# EAGLE design adsr-schematic (EAGLE 9.5.2)
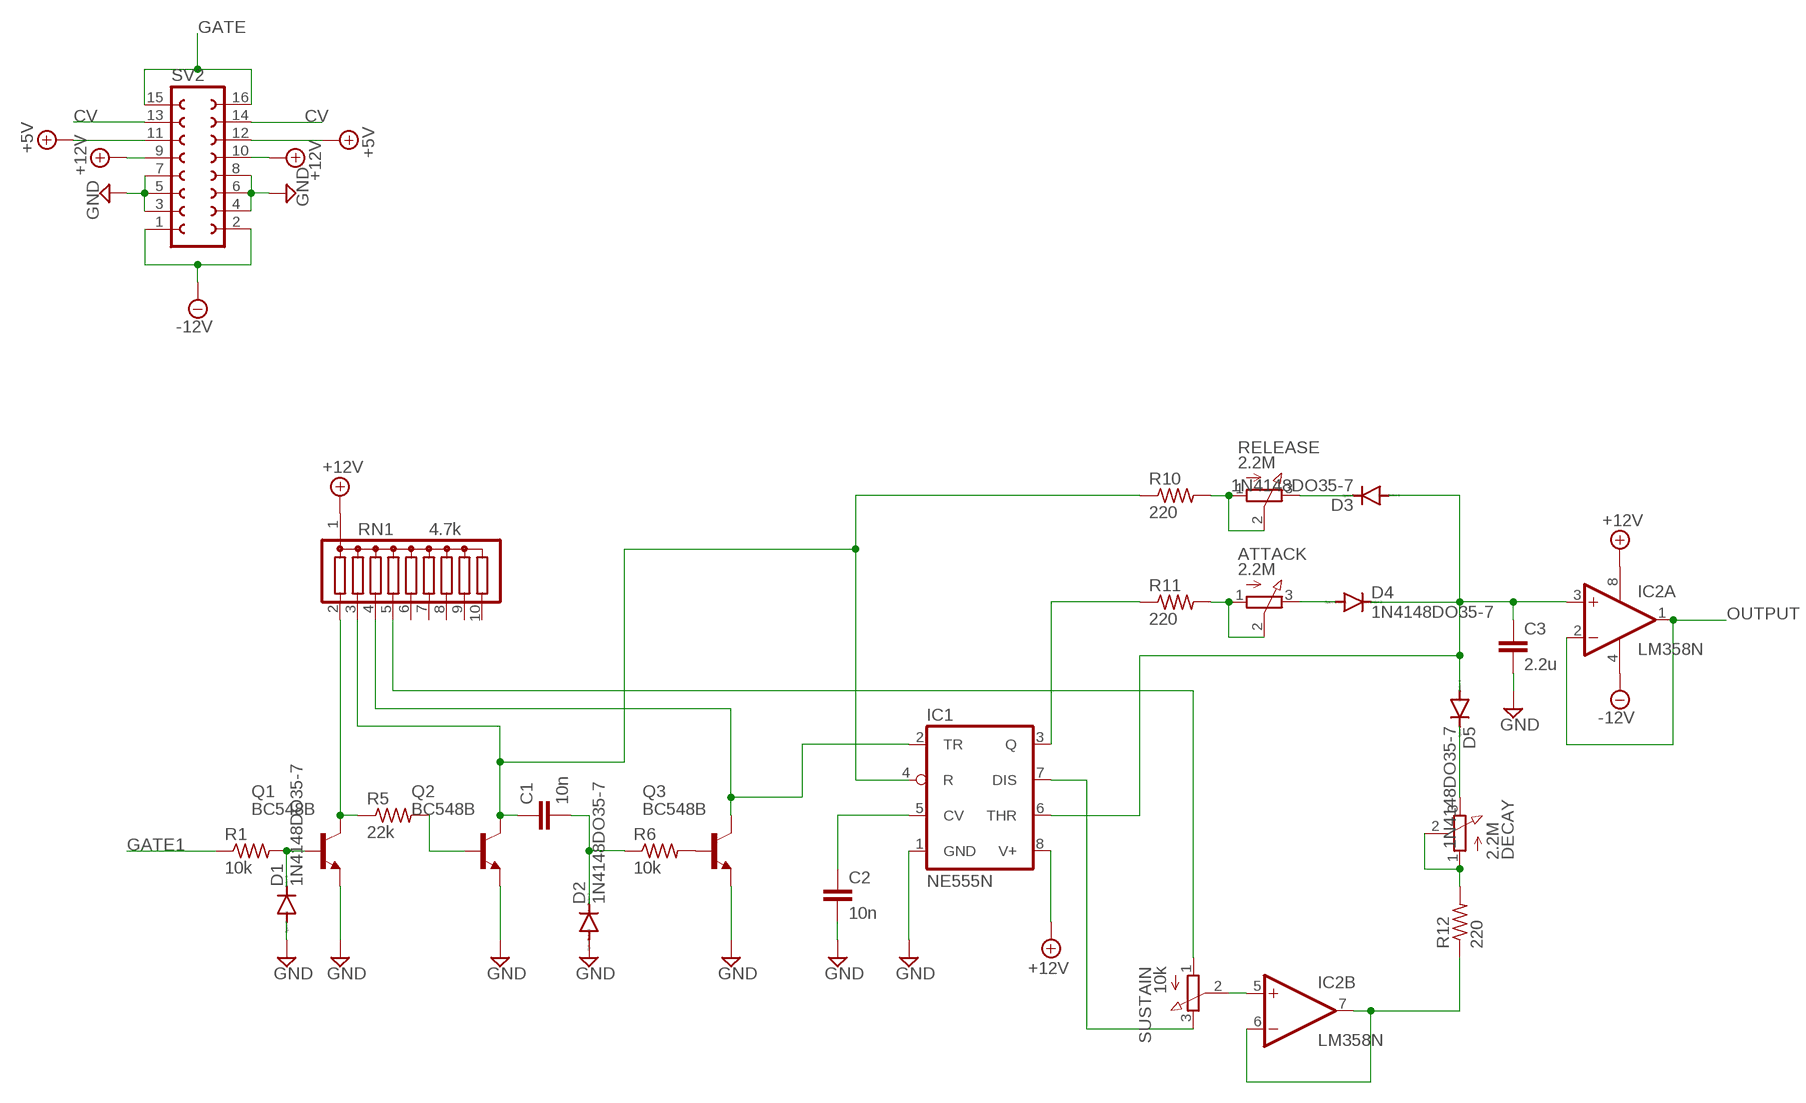
[diagram p0: schematic, sheet 1]

## Parts
ATTACK  2.2M  3RP/1610N  [3RP/1610N]
C1  10n  C2.5/4  [C2.5-4]
C2  10n  C2.5/4  [C2.5-4]
C3  2.2u  C2.5/4  [C2.5-4]
D1  1N4148DO35-7  [DO35-7]
D2  1N4148DO35-7  [DO35-7]
D3  1N4148DO35-7  [DO35-7]
D4  1N4148DO35-7  [DO35-7]
D5  1N4148DO35-7  [DO35-7]
DECAY  2.2M  3RP/1610N  [3RP/1610N]
IC1  NE555N  [DIL08]
IC2  LM358N  [DIL08]
Q1  BC548B  [TO92-EBC]
Q2  BC548B  [TO92-EBC]
Q3  BC548B  [TO92-EBC]
R1  10k  R-US_0204/5  [0204/5]
R5  22k  R-US_0204/5  [0204/5]
R6  10k  R-US_0204/5  [0204/5]
R10  220  R-US_0204/5  [0204/5]
R11  220  R-US_0204/5  [0204/5]
R12  220  R-US_0204/5  [0204/5]
RELEASE  2.2M  3RP/1610N  [3RP/1610N]
RN1  4.7k  G09R  [SIL10]
SUSTAIN  10k  3RP/1610N  [3RP/1610N]
SV2  FE08-2W  [FE08-2W]

## Nets
+5V: SV2.11 SV2.12
+12V: IC1.8(V+) IC2.8(P:V+) RN1.1 SV2.9 SV2.10
-12V: IC2.4(P:V-) SV2.1 SV2.2
CV: SV2.13 SV2.14
GATE: SV2.15 SV2.16
GATE1: R1.1
GND: C2.2 C3.2 D1.A D2.A IC1.1(GND) Q1.E Q2.E Q3.E SV2.3 SV2.4 SV2.5 SV2.6 SV2.7 SV2.8
N$1: D1.C Q1.B R1.2
N$2: Q1.C R5.1 RN1.2
N$3: C1.1 IC1.4(R) Q2.C R10.1 RN1.3
N$4: IC1.2(TR) Q3.C RN1.4
N$5: Q2.B R5.2
N$6: Q3.B R6.2
N$7: C1.2 D2.C R6.1
N$8: R10.2 RELEASE.1(A) RELEASE.2(S)
N$9: ATTACK.1(A) ATTACK.2(S) R11.2
N$10: DECAY.1(A) DECAY.2(S) R12.2
N$11: ATTACK.3(E) D4.A
N$12: C3.1 D3.A D4.C D5.A IC1.6(THR) IC2.3(A:+IN)
N$13: D5.C DECAY.3(E)
N$14: IC1.3(Q) R11.1
N$15: C2.1 IC1.5(CV)
N$16: IC2.5(B:+IN) SUSTAIN.2(S)
N$17: RN1.5 SUSTAIN.1(A)
N$18: IC2.6(B:-IN) IC2.7(B:OUT) R12.1
N$19: D3.C RELEASE.3(E)
N$20: IC1.7(DIS) SUSTAIN.3(E)
OUTPUT: IC2.1(A:OUT) IC2.2(A:-IN)
Unconnected: RN1.6 RN1.7 RN1.8 RN1.9 RN1.10

## Library data of the parts
ATTACK DECAY RELEASE SUSTAIN = pot:3RP/1610N: 16mm Potentiometer one level Source: http://www.alphapotentiometers.net/html/16mm_pot_2.html
C1-C3 = capacitor-wima:C: CAPACITOR naming: grid - package width
D1-D5 = diode:1N4148: DIODE high speed (Philips)
IC1 = linear:*555: TIMER
IC2 = linear:LM358: OP AMP also LM158; LM258; LM2904 Source: http://cache.national.com/ds/LM/LM158.pdf
Q1-Q3 = transistor-npn:BC548*: NPN Transistor
R1 R5 R6 R10-R12 = rcl:R-US_: RESISTOR, American symbol; SPICEPREFIX: R
RN1 = resistor-sil:G09R: SIL RESISTOR; OC_FARNELL: unknown; OC_NEWARK: unknown
SV2 = con-lsta:FE08-2W: FEMALE HEADER; OC_FARNELL: unknown; OC_NEWARK: unknown

## Board
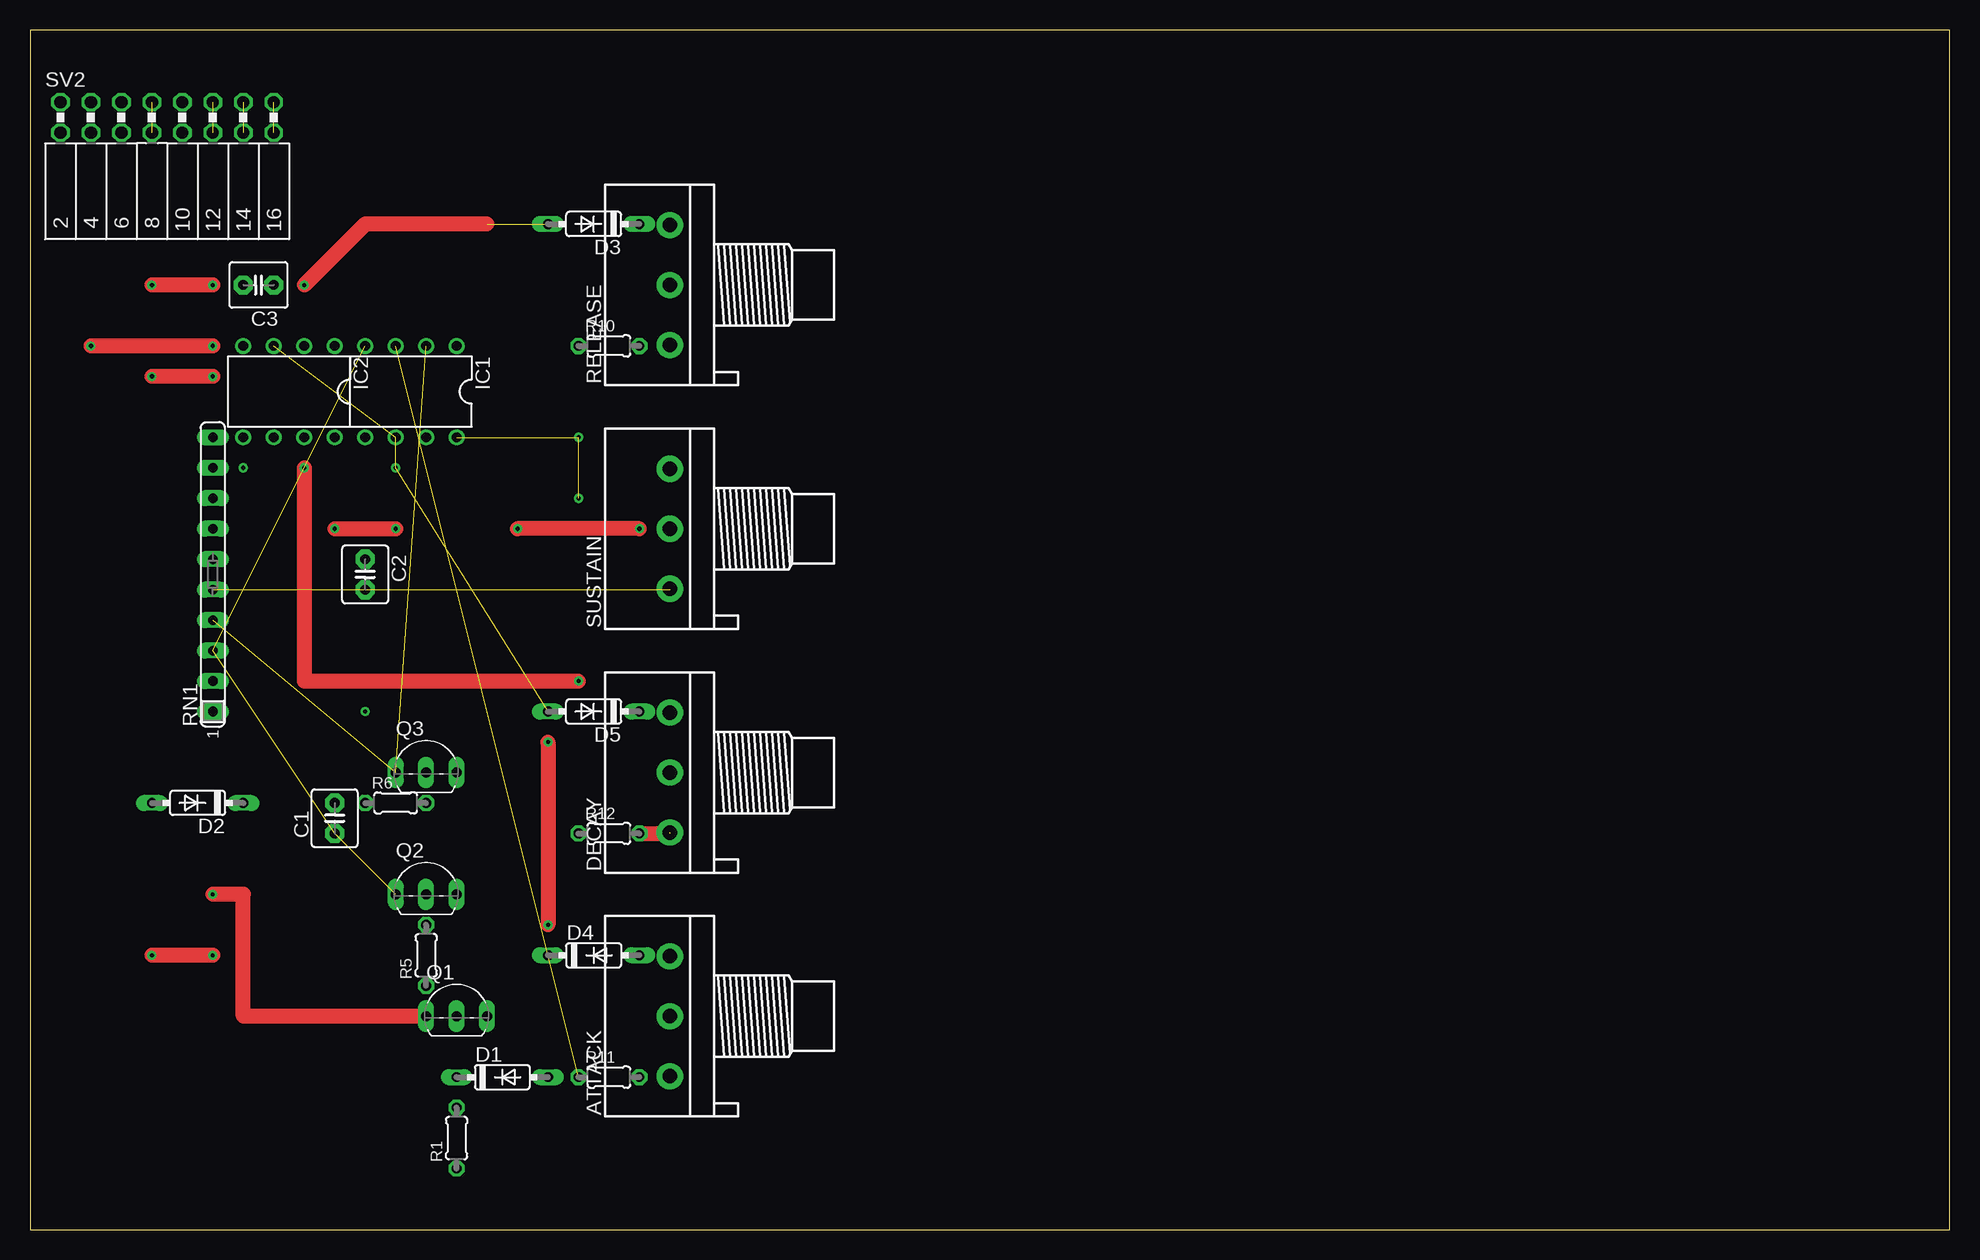
[diagram p1: board, top side]
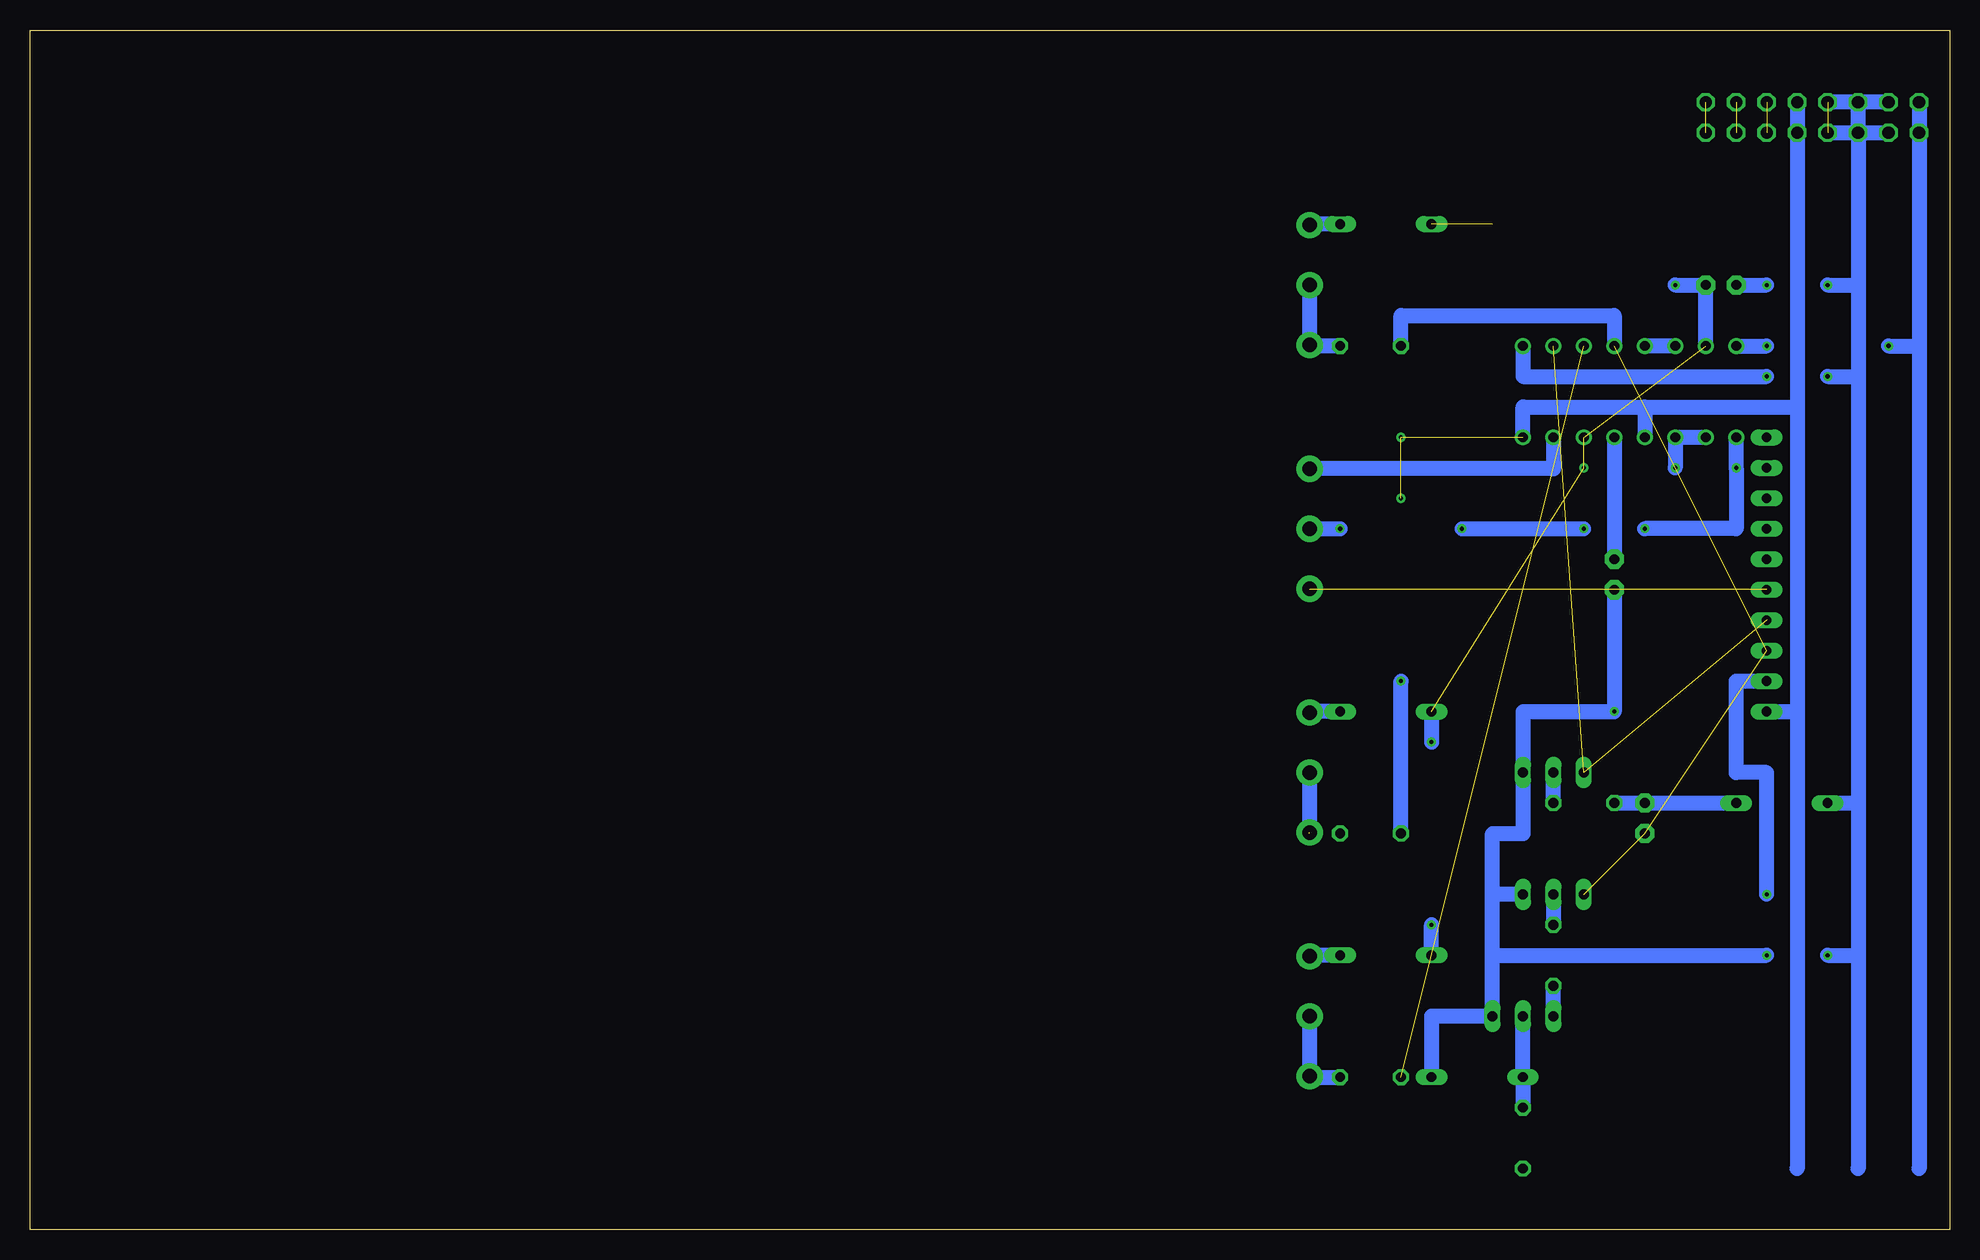
[diagram p2: board, bottom side, seen from below]

Size 160 x 100 mm. Coordinates in mm from the lower left corner, seen from the top.
Outline: 0,0 160,0 160,100 0,100 0,0
Copper layers (1*16): Top 0.035mm / dielectric 0.15mm / Bottom 0.035mm
Design rules "default": minimum track width 6mil, minimum drill 0.35mm, track to track 6mil, track to pad 6mil, pad to pad 6mil, via to via 6mil, smd to smd 6mil, copper to edge 40mil, drill to drill 6mil, minimum pad ring 10mil, minimum via ring 8mil, stop-mask expansion 4mil, vias tented up to drill 0mil, thermal gap 10mil

### Footprints (pad centres in the part's own frame; a part is rotated, then mirrored left to right if it is on the bottom)
3RP/1610N = drill 1.2 pad 2.184: 1 -5,0; 2 0,0; 3 5,0
C2.5-4 = drill 0.813 pad 1.6 octagon: 1 -1.27,0; 2 1.27,0
DO35-7 = drill 0.813 long: A 3.81,0; C -3.81,0
DIL08 = drill 0.813 pad 1.27: 1 -3.81,-3.81; 2 -1.27,-3.81; 3 1.27,-3.81; 4 3.81,-3.81; 5 3.81,3.81; 6 1.27,3.81; 7 -1.27,3.81; 8 -3.81,3.81
TO92-EBC = drill 0.813 long: B 0,-1.27; C -2.54,-1.27; E 2.54,-1.27
0204/5 = drill 0.813 octagon: 1 -2.54,0; 2 2.54,0
SIL10 = drill 0.813 long: 1 -11.43,0; 2 -8.89,0; 3 -6.35,0; 4 -3.81,0; 5 -1.27,0; 6 1.27,0; 7 3.81,0; 8 6.35,0; 9 8.89,0; 10 11.43,0
FE08-2W = drill 1.016 octagon: 1 -8.89,1.27; 2 -8.89,-1.27; 3 -6.35,1.27; 4 -6.35,-1.27; 5 -3.81,1.27; 6 -3.81,-1.27; 7 -1.27,1.27; 8 -1.27,-1.27; 9 1.27,1.27; 10 1.27,-1.27; 11 3.81,1.27; 12 3.81,-1.27; 13 6.35,1.27; 14 6.35,-1.27; 15 8.89,1.27; 16 8.89,-1.27

### Placement (x,y rotation side)
ATTACK  53.34,17.78 90 top
C1  25.4,34.29 90 top
C2  27.94,54.61 270 top
C3  19.05,78.74 180 top
D1  39.37,12.7 0 top
D2  13.97,35.56 180 top
D3  46.99,83.82 180 top
D4  46.99,22.86 0 top
D5  46.99,43.18 180 top
DECAY  53.34,38.1 90 top
IC1  31.75,69.85 180 top
IC2  21.59,69.85 180 top
Q1  35.56,19.05 0 top
Q2  33.02,29.21 0 top
Q3  33.02,39.37 0 top
R1  35.56,7.62 90 top
R5  33.02,22.86 90 top
R6  30.48,35.56 0 top
R10  48.26,73.66 0 top
R11  48.26,12.7 0 top
R12  48.26,33.02 0 top
RELEASE  53.34,78.74 90 top
RN1  15.24,54.61 90 top
SUSTAIN  53.34,58.42 90 top
SV2  11.43,92.71 0 top

### Tracks (layer width: path | path; a pad name or v marks a point on that pad's centre or on a via)
+5V  (1 unrouted)
+12V  (via drill 0.35)  (2 unrouted)
  Bottom 1.27: SV2.9 SV2.10 12.7,68.58 | 12.7,68.58 12.7,43.18 | 12.7,43.18 12.7,5.08 | IC1.8 35.56,68.58 25.4,68.58 | 25.4,68.58 IC2.8 | 25.4,68.58 12.7,68.58 | RN1.1 12.7,43.18
  other vias: 45.72,66.04 45.72,60.96
-12V  (via drill 0.35)
  Top 1.27: v15.24,73.66 v5.08,73.66
  Bottom 1.27: SV2.1 SV2.2 2.54,73.66 | 2.54,73.66 2.54,5.08 | IC2.4 v15.24,73.66 | v5.08,73.66 2.54,73.66
CV  (1 unrouted)
GATE  (1 unrouted)
GND  (via drill 0.35)  (1 unrouted)
  Top 1.27: v15.24,71.12 v10.16,71.12 | v15.24,22.86 v10.16,22.86 | v15.24,78.74 v10.16,78.74
  Bottom 1.27: SV2.3 SV2.5 | SV2.8 SV2.4 | SV2.5 SV2.6 7.62,78.74 | SV2.5 SV2.7 | 7.62,78.74 7.62,71.12 | 7.62,71.12 7.62,35.56 | 7.62,35.56 7.62,22.86 | 7.62,22.86 7.62,5.08 | 38.1,27.94 38.1,33.02 35.56,33.02 Q3.E 35.56,43.18 v27.94,43.18 C2.2 | Q2.E 38.1,27.94 | D1.A 43.18,17.78 Q1.E 38.1,22.86 | D2.A 7.62,35.56 | v10.16,78.74 7.62,78.74 | IC1.1 35.56,71.12 v15.24,71.12 | v10.16,71.12 7.62,71.12 | 38.1,22.86 38.1,27.94 | 38.1,22.86 v15.24,22.86 | v10.16,22.86 7.62,22.86 | C3.2 v15.24,78.74
N$1
  Bottom 1.27: R1.2 D1.C Q1.B
N$2  (via drill 0.35)
  Top 1.27: Q1.C 17.78,17.78 17.78,27.94 v15.24,27.94
  Bottom 1.27: Q1.C R5.1 | v15.24,27.94 15.24,38.1 17.78,38.1 17.78,45.72 RN1.2
N$3  (3 unrouted)
  Bottom 1.27: R10.1 45.72,76.2 27.94,76.2 IC1.4
N$4  (2 unrouted)
N$5
  Bottom 1.27: Q2.B R5.2
N$6
  Bottom 1.27: R6.2 Q3.B
N$7
  Bottom 1.27: R6.1 C1.2 D2.C
N$8
  Bottom 1.27: R10.2 53.34,73.66 RELEASE.1 RELEASE.2
N$9
  Bottom 1.27: R11.2 53.34,12.7 ATTACK.1 ATTACK.2
N$10  (2 unrouted)
  Top 1.27: R12.2 53.34,33.02
  Bottom 1.27: DECAY.2 53.34,33.02
N$11
  Bottom 1.27: D4.A 53.34,22.86 ATTACK.3
N$12  (via drill 0.35)  (4 unrouted)
  Top 1.27: 38.1,83.82 27.94,83.82 v22.86,78.74 | v43.18,40.64 v43.18,25.4
  Bottom 1.27: IC2.3 C3.1 v22.86,78.74 | D4.C v43.18,25.4 | D5.A v43.18,40.64
  other vias: 30.48,63.5
N$13
  Bottom 1.27: D5.C 53.34,43.18 DECAY.3
N$14  (1 unrouted)
N$15
  Bottom 1.27: IC1.5 C2.1
N$16  (via drill 0.35)
  Top 1.27: v50.8,58.42 v40.64,58.42 | v25.4,58.42 v30.48,58.42
  Bottom 1.27: SUSTAIN.2 v50.8,58.42 | IC2.5 v17.78,63.5 17.78,58.42 v25.4,58.42 | v40.64,58.42 v30.48,58.42
N$17  (1 unrouted)
  Bottom 1.27: 53.34,53.34 SUSTAIN.1
N$18  (via drill 0.35)
  Top 1.27: v22.86,63.5 22.86,45.72 v45.72,45.72
  Bottom 1.27: IC2.6 IC2.7 v22.86,63.5 | R12.1 v45.72,45.72
N$19
  Bottom 1.27: D3.C 53.34,83.82 RELEASE.3
N$20
  Bottom 1.27: SUSTAIN.3 33.02,63.42 IC1.7
OUTPUT
  Bottom 1.27: IC2.2 IC2.1